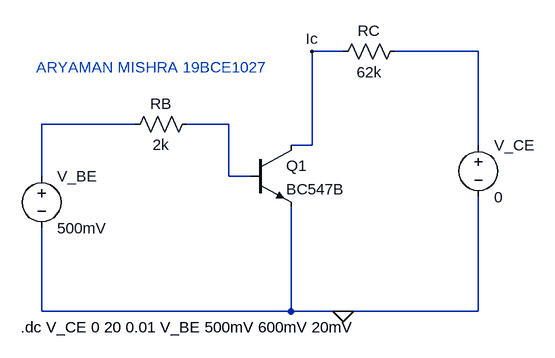
[diagram p0: schematic Draft3.asc]
Draft3.asc, the LTspice schematic file:
Version 4
SHEET 1 880 680
WIRE 528 -64 480 -64
WIRE 736 -64 608 -64
WIRE 208 48 64 48
WIRE 352 48 288 48
WIRE 480 80 480 -64
WIRE 480 80 448 80
WIRE 736 80 736 -64
WIRE 64 128 64 48
WIRE 352 128 352 48
WIRE 384 128 352 128
WIRE 64 336 64 208
WIRE 448 336 448 176
WIRE 448 336 64 336
WIRE 528 336 448 336
WIRE 736 336 736 160
WIRE 736 336 528 336
FLAG 528 336 0
FLAG 480 -64 Ic
SYMBOL voltage 64 112 R0
WINDOW 123 0 0 Left 0
WINDOW 39 0 0 Left 0
SYMATTR InstName V_BE
SYMATTR Value 500mV
SYMBOL voltage 736 64 R0
WINDOW 123 0 0 Left 0
WINDOW 39 0 0 Left 0
SYMATTR InstName V_CE
SYMATTR Value 0
SYMBOL res 304 32 R90
WINDOW 0 0 56 VBottom 2
WINDOW 3 32 56 VTop 2
SYMATTR InstName RB
SYMATTR Value 2k
SYMBOL res 624 -80 R90
WINDOW 0 0 56 VBottom 2
WINDOW 3 32 56 VTop 2
SYMATTR InstName RC
SYMATTR Value 62k
SYMBOL npn 384 80 R0
SYMATTR InstName Q1
SYMATTR Value BC547B
TEXT 32 360 Left 2 !.dc V_CE 0 20 0.01 V_BE 500mV 600mV 20mV
TEXT 56 -40 Left 2 ;ARYAMAN MISHRA 19BCE1027

The netlist it stands for:
* Draft3.asc
V_BE N002 0 500mV
V_CE N001 0 0
RB N003 N002 2k
RC N001 Ic 62k
Q1 Ic N003 0 0 BC547B
.model NPN NPN
.model PNP PNP
.lib standard.bjt
.dc V_CE 0 20 0.01 V_BE 500mV 600mV 20mV
* ARYAMAN MISHRA 19BCE1027
.backanno
.end